# Altium schematic sheet ELC102 - Old Circuits.SchDoc
size C
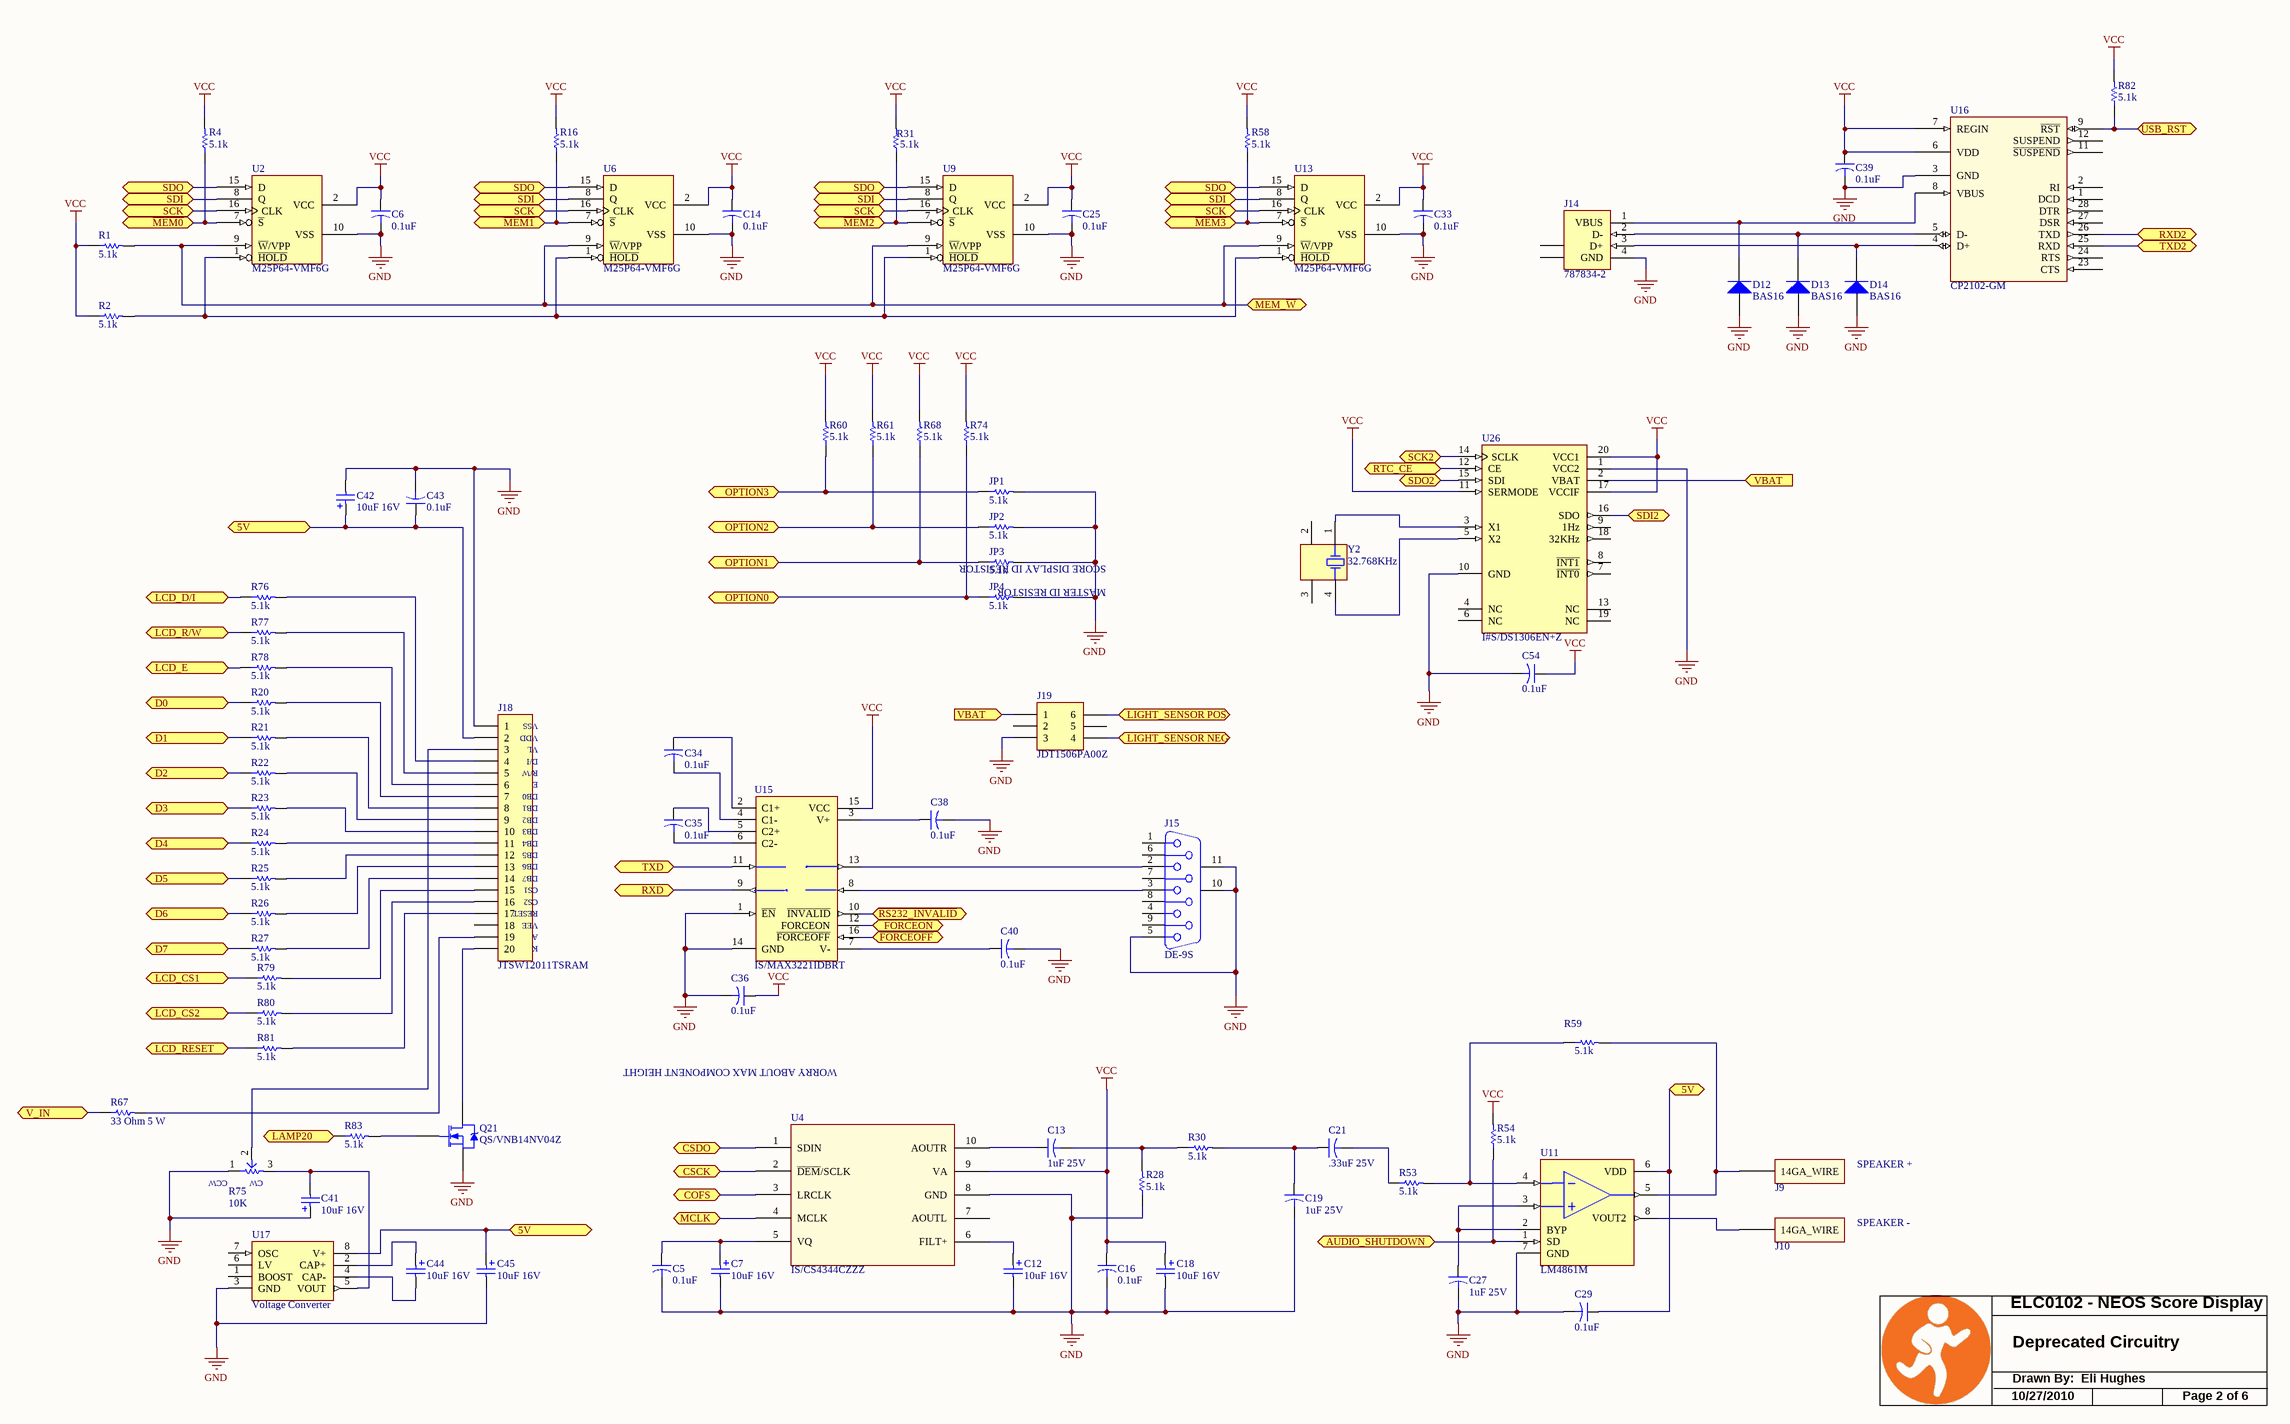
[diagram p0: ELC102 - Old Circuits.SchDoc]

## Parts
C5  0.1uF  [C0805]
C6  0.1uF  [C0805]
C7  10uF 16V  [C4X5.8]
C12  10uF 16V  [C4X5.8]
C13  1uF 25V  [R1206]
C14  0.1uF  [C0805]
C16  0.1uF  [C0805]
C18  10uF 16V  [C4X5.8]
C19  1uF 25V  [R1206]
C21  .33uF 25V  [R1206]
C25  0.1uF  [C0805]
C27  1uF 25V  [R1206]
C29  0.1uF  [C0805]
C33  0.1uF  [C0805]
C34  0.1uF  [C0805]
C35  0.1uF  [C0805]
C36  0.1uF  [C0805]
C38  0.1uF  [C0805]
C39  0.1uF  [C0805]
C40  0.1uF  [C0805]
C41  10uF 16V  [C4X5.8]
C42  10uF 16V  [C4X5.8]
C43  0.1uF  [C0805]
C44  10uF 16V  [C4X5.8]
C45  10uF 16V  [C4X5.8]
C54  0.1uF  [C0805]
D12  BAS16  [SOT23]  (no BOM)
D13  BAS16  [SOT23]  (no BOM)
D14  BAS16  [SOT23]  (no BOM)
J9  ~14GA_WIRE  [WIRE_14GA]  (value not drawn)  (no BOM)
J10  ~14GA_WIRE  [WIRE_14GA]  (value not drawn)  (no BOM)
J14  787834-2  [KUSBVX-BS1N]  (no BOM)
J15  DE-9S  [DSUBV9]  (no BOM)
J18  JTSW12011TSRAM  [JTSW12011TSRAM]
J19  JDT1506PA00Z  [JDT1506PA00Z - 2 holes]
JP1  5.1k  [R0805]
JP2  5.1k  [R0805]
JP3  5.1k  [R0805]
JP4  5.1k  [R0805]
Q21  QS/VNB14NV04Z  [D2PAK]
R1  5.1k  [R0805]
R2  5.1k  [R0805]
R4  5.1k  [R0805]
R16  5.1k  [R0805]
R20  5.1k  [R0805]
R21  5.1k  [R0805]
R22  5.1k  [R0805]
R23  5.1k  [R0805]
R24  5.1k  [R0805]
R25  5.1k  [R0805]
R26  5.1k  [R0805]
R27  5.1k  [R0805]
R28  5.1k  [R0805]
R30  5.1k  [R0805]
R31  5.1k  [R0805]
R53  5.1k  [R0805]
R54  5.1k  [R0805]
R58  5.1k  [R0805]
R59  5.1k  [R0805]
R60  5.1k  [R0805]
R61  5.1k  [R0805]
R67  33 Ohm 5 W  [RES30.6-25.5X9]
R68  5.1k  [R0805]
R74  5.1k  [R0805]
R75  10K  [P3299W]
R76  5.1k  [R0805]
R77  5.1k  [R0805]
R78  5.1k  [R0805]
R79  5.1k  [R0805]
R80  5.1k  [R0805]
R81  5.1k  [R0805]
R82  5.1k  [R0805]
R83  5.1k  [R0805]
U2  M25P64-VMF6G  [so16w]  (no BOM)
U4  IS/CS4344CZZZ  [TSSOP\10]
U6  M25P64-VMF6G  [so16w]  (no BOM)
U9  M25P64-VMF6G  [so16w]  (no BOM)
U11  LM4861M  [soic 8]
U13  M25P64-VMF6G  [so16w]  (no BOM)
U15  IS/MAX3221IDBRT  [SSOP16]  (no BOM)
U16  CP2102-GM  [QFN28]  (no BOM)
U17  Voltage Converter  [SOIC 8]
U26  I#S/DS1306EN+Z  [TSSOP-20]
Y2  32.768KHz  [ZS/MC306]

## Ports
5V, AUDIO_SHUTDOWN, COFS, CSCK, CSDO, D0, D1, D2, D3, D4, D5, D6, D7, FORCEON, LAMP20, LCD_CS1, LCD_CS2, LCD_D/I, LCD_E, LCD_R/W, LCD_RESET, LIGHT_SENSOR NEG, LIGHT_SENSOR POS, MCLK, MEM_~{W}, OPTION0, OPTION1, OPTION2, OPTION3, RTC_CE, RXD, RXD2, SCK, SCK2, SDI, SDI2, SDO, SDO2, TXD, TXD2, USB_RST, V_IN, VBAT (in), ~{FORCEOFF}, ~{MEM0}, ~{MEM1}, ~{MEM2}, ~{MEM3}, ~{RS232_INVALID}

## Nets
GND: C5.2 C6.2 C7.2 C12.2 C14.2 C16.2 C18.2 C19.2 C25.2 C27.2 C29.2 C33.2 C36.2 C38.2 C39.2 C40.2 C41.1 C42.2 C43.2 C45.2 C54.2 D12.1(A) D13.1(A) D14.1(A) J14.4(GND) J15.5 J15.10(MH1) J15.11(MH2) J18.1 J19.3 JP1.2 JP2.2 JP3.2 JP4.2 Q21.3(S) R28.1 R75.1(CCW) U2.10(VSS) U4.8(GND) U6.10(VSS) U9.10(VSS) U11.7(GND) U13.10(VSS) U15.1(~{EN}) U15.14(GND) U16.3(GND) U17.3(GND) U26.1(VCC2) U26.10(GND)
VCC: C6.1 C14.1 C16.1 C18.1 C25.1 C33.1 C36.1 C39.1 C54.1 R1.1 R2.1 R4.2 R16.2 R31.2 R54.2 R58.2 R60.2 R61.2 R68.2 R74.2 R82.2 U2.2(VCC) U4.9(VA) U6.2(VCC) U9.2(VCC) U13.2(VCC) U15.15(VCC) U16.6(VDD) U16.7(REGIN) U26.11(SERMODE) U26.17(VCCIF) U26.20(VCC1)
5V: C29.1 C42.1 C43.1 C45.1 J18.2 U11.6(VDD) U17.8(V+) ; port 5V
AUDIO_SHUTDOWN: R54.1 U11.1(SD) ; port AUDIO_SHUTDOWN
COFS: U4.3(LRCLK) ; port COFS
CSCK: U4.2(~{DEM}/SCLK) ; port CSCK
CSDO: U4.1(SDIN) ; port CSDO
D0: R20.1 ; port D0
D1: R21.1 ; port D1
D2: R22.1 ; port D2
D3: R23.1 ; port D3
D4: R24.1 ; port D4
D5: R25.1 ; port D5
D6: R26.1 ; port D6
D7: R27.1 ; port D7
~{FORCEOFF}: U15.16(~{FORCEOFF}) ; port ~{FORCEOFF}
FORCEON: U15.12(FORCEON) ; port FORCEON
LAMP20: R83.1 ; port LAMP20
LCD_CS1: R79.1 ; port LCD_CS1
LCD_CS2: R80.1 ; port LCD_CS2
LCD_D/I: R76.1 ; port LCD_D/I
LCD_E: R78.1 ; port LCD_E
LCD_R/W: R77.1 ; port LCD_R/W
LCD_RESET: R81.1 ; port LCD_RESET
LIGHT_SENSOR NEG: J19.4 ; port LIGHT_SENSOR NEG
LIGHT_SENSOR POS: J19.6 ; port LIGHT_SENSOR POS
~{MEM0}: R4.1 U2.7(~{S}) ; port ~{MEM0}
~{MEM1}: R16.1 U6.7(~{S}) ; port ~{MEM1}
~{MEM2}: R31.1 U9.7(~{S}) ; port ~{MEM2}
~{MEM3}: R58.1 U13.7(~{S}) ; port ~{MEM3}
MCLK: U4.4(MCLK) ; port MCLK
MEM_~{W}: R1.2 U2.9(~{W}/VPP) U6.9(~{W}/VPP) U9.9(~{W}/VPP) U13.9(~{W}/VPP) ; port MEM_~{W}
OPTION0: JP4.1 R74.1 ; port OPTION0
OPTION1: JP3.1 R68.1 ; port OPTION1
OPTION2: JP2.1 R61.1 ; port OPTION2
OPTION3: JP1.1 R60.1 ; port OPTION3
~{RS232_INVALID}: U15.10(~{INVALID}) ; port ~{RS232_INVALID}
RTC_CE: U26.12(CE) ; port RTC_CE
RXD: U15.9(R1OUT) ; port RXD
RXD2: U16.26(TXD) ; port RXD2
SCK: U2.16(CLK) U6.16(CLK) U9.16(CLK) U13.16(CLK) ; port SCK
SCK2: U26.14(SCLK) ; port SCK2
SDI: U2.8(Q) U6.8(Q) U9.8(Q) U13.8(Q) ; port SDI
SDI2: U26.16(SDO) ; port SDI2
SDO: U2.15(D) U6.15(D) U9.15(D) U13.15(D) ; port SDO
SDO2: U26.15(SDI) ; port SDO2
TXD: U15.11(T1IN) ; port TXD
TXD2: U16.25(RXD) ; port TXD2
USB_RST: R82.1 U16.9(~{RST}) ; port USB_RST
V_IN: R67.1 ; port V_IN
VBAT: J19.1 U26.2(VBAT) ; port VBAT
NetC5_1: C5.1 C7.1 U4.5(VQ)
NetC12_1: C12.1 U4.6(FILT+)
NetC13_1: C13.1 U4.10(AOUTR)
NetC13_2: C13.2 R28.2 R30.1
NetC19_1: C19.1 C21.1 R30.2
NetC21_2: C21.2 R53.1
NetC27_1: C27.1 U11.2(BYP) U11.3(IN+)
NetC34_1: C34.1 U15.2(C1+)
NetC34_2: C34.2 U15.4(C1-)
NetC35_1: C35.1 U15.5(C2+)
NetC35_2: C35.2 U15.6(C2-)
NetC38_1: C38.1 U15.3(V+)
NetC40_1: C40.1 U15.7(V-)
NetC41_2: C41.2 R75.3(CW) U17.5(VOUT)
NetC44_1: C44.1 U17.2(CAP+)
NetC44_2: C44.2 U17.4(CAP-)
NetD12_3: D12.3(K) J14.1(VBUS) U16.8(VBUS)
NetD13_3: D13.3(K) J14.2(D-) U16.5(D-)
NetD14_3: D14.3(K) J14.3(D+) U16.4(D+)
NetJ9_1: J9.1(14GA_WIRE) R59.2 U11.5(VOUT1)
NetJ10_1: J10.1(14GA_WIRE) U11.8(VOUT2)
NetJ15_2: J15.2 U15.13(T1OUT)
NetJ15_3: J15.3 U15.8(R1IN)
NetJ18_3: J18.3 R75.2(T)
NetJ18_4: J18.4 R76.2
NetJ18_5: J18.5 R77.2
NetJ18_6: J18.6 R78.2
NetJ18_7: J18.7 R20.2
NetJ18_8: J18.8 R21.2
NetJ18_9: J18.9 R22.2
NetJ18_10: J18.10 R23.2
NetJ18_11: J18.11 R24.2
NetJ18_12: J18.12 R25.2
NetJ18_13: J18.13 R26.2
NetJ18_14: J18.14 R27.2
NetJ18_15: J18.15 R79.2
NetJ18_16: J18.16 R80.2
NetJ18_17: J18.17 R81.2
NetJ18_19: J18.19 R67.2
NetJ18_20: J18.20 Q21.2(D)
NetQ21_1: Q21.1(G) R83.2
NetR2_2: R2.2 U2.1(~{HOLD}) U6.1(~{HOLD}) U9.1(~{HOLD}) U13.1(~{HOLD})
NetR53_2: R53.2 R59.1 U11.4(IN-)
NetU26_3: U26.3(X1) Y2.1(OSC1)
NetU26_5: U26.5(X2) Y2.4(OSC2)

Not connected (* = marked no-connect by the designer): J14 5(SHLD) 6(SHLD); J15 1 4 6 7 8 9; J18 18; J19 2 5; U4 7(AOUTL); U16 1(DCD) 2(RI) 11(~{SUSPEND}) 12(SUSPEND) 23(CTS) 24(RTS) 27(DSR) 28(DTR); U17 1(BOOST) 6(LV) 7(OSC); U26 4(NC) 6(NC) 7(~{INT0}) 8(~{INT1}) 9(1Hz) 13(NC) 18(32KHz) 19(NC); Y2 2(COM) 3(COM)

## Notes on the sheet
- MASTER ID RESISTOR
- SCORE DISPLAY ID RESISTOR
- (near J18) VSS
- (near J18) VDD
- (near J18) VL
- (near J18) R/W
- (near J18) D/I
- (near J18) E
- (near J18) DB0
- (near J18) DB1
- (near J18) DB2
- (near J18) DB3
- (near J18) DB4
- (near J18) DB5
- (near J18) DB6
- (near J18) DB7
- (near J18) CS1
- (near J18) CS2
- (near J18) RESET
- (near J18) VEE
- (near J18) A
- (near J18) K
- WORRY ABOUT MAX COMPONENT HEIGHT
- SPEAKER +
- SPEAKER -
- ELC0102 - NEOS Score Display
- Deprecated Circuitry
- 10/27/2010
- Drawn By:  Eli Hughes
- Page 2 of 6

## Library data of the parts
C5 C6 C14 C16 C25 C29 C33-C36 C38-C40 C43 C54 = CS/C0805C104K5RACK: CAP .10UF 50V CERAMIC X7R 0805; Manufacturer: Kemet; Manufacturer Part Number: C0805C104K5RACTU; Source Part Number: 399-1170-2-ND; Capacitance: 0.1µF; Tolerance: ±10%; ROHS Certificate: Lead free / RoHS compliant; Source: Digikey; Value: 0.1uF; Supplier 1: Digi-Key; RoHS: RoHS Compliant; Category: Capacitors; Stock 1: 10120790; Pricing 1: 10=0.105, 100=0.0378, 250=0.02732, 500=0.02016, 1000=0.01365 (USD); Voltage - Rated: 50V; Temperature Coefficient: X7R; Mounting Type: Surface Mount, MLCC; Operating Temperature: -55°C ~ 125°C; Features: -; Applications: General Purpose; Ratings: -; Package / Case: 0805 (2012 Metric); Size / Dimension: 0.079" L x 0.049" W (2.00mm x 1.25mm); Lead Spacing: -; Thickness: 0.90mm; Packaging: Cut Tape (CT); Lead Style: -; ComponentLink1URL: http://www.kemet.com/datasheets&C0805C104K5RACTU; ComponentLink1Description: http://www.kemet.com/datasheets&C0805C104K5RACTU; Supplier Part Number 1: 399-1170-1-ND
C7 C12 C18 C41 C42 C44 C45 = CS/EEVFK1C100RP: Panasonic 10uF 16V SMT; Manufacturer: Panasonic - ECG; Manufacturer Part Number: EEE-FK1C100R; Source Part Number: PCE3782TR-ND; Value: EEE-FK1C100R; Description: CAP ELECT 10UF 16V FK SMD; Capacitance: 10µF; Tolerance: ±20%; Lifetime @ Temp.: 2000 Hrs @ 105°C; Ripple Current: 90mA; Impedance: 1.35 Ohm; Surface Mount Land Size: 0.169" L x 0.169" W (4.30mm x 4.30mm); ROHS Certificate: Lead free / RoHS compliant; Source: Digikey; Supplier 1: Digi-Key; RoHS: RoHS Compliant; Category: Capacitors; Stock 1: 412703; Pricing 1: 1=0.54, 50=0.309, 100=0.2575, 250=0.19312, 500=0.1648, 1000=0.12875 (USD); Voltage Rating: 16V; Operating Temperature: -55°C ~ 105°C; Features: General Purpose; ESR (Equivalent Series Resistance): -; Mounting Type: Surface Mount; Package / Case: Radial, Can - SMD; Size / Dimension: 0.157" Dia (4.00mm); Height: 0.228" (5.80mm); Lead Spacing: -; Packaging: Cut Tape (CT); ComponentLink1URL: http://industrial.panasonic.com/www-cgi/jvcr13pz.cgi?E+PZ+3+ABA0120+EEEFK1C100R+7+WW; ComponentLink1Description: http://industrial.panasonic.com/www-cgi/jvcr13pz.cgi?E+PZ+3+ABA0120+EEEFK1C100R+7+WW; Supplier Part Number 1: PCE3782CT-ND
C13 C19 C27 = CS/ECJ3YB1E105KP: 1uF 25V 1206 Panasonic; Manufacturer: Panasonic - ECG; Manufacturer Part Number: ECJ-3YB1E105K; Description: CAP 1UF 25V CERAMIC X7R 1206; Capacitance: 1.0µF; Tolerance: ±10%; Temperature Coefficient: X7R; Published: 23-Sep-2002; Publisher: Altium Limited; Supplier 1: Digi-Key; RoHS: RoHS Compliant; Category: Capacitors; Stock 1: 0; Voltage - Rated: 25V; Mounting Type: Surface Mount, MLCC; Operating Temperature: -55°C ~ 125°C; Features: Low ESR; Applications: General Purpose; Ratings: -; Package / Case: 1206 (3216 Metric); Size / Dimension: 0.126" L x 0.063" W (3.20mm x 1.60mm); Lead Spacing: -; Thickness: 1.60mm; Packaging: Cut Tape (CT); Lead Style: -; ComponentLink1URL: http://media.digikey.com/pdf/Data%20Sheets/Panasonic%20Capacitors%20PDFs/ECJ(HighCapacitance).pdf; ComponentLink1Description: http://media.digikey.com/pdf/Data%20Sheets/Panasonic%20Capacitors%20PDFs/ECJ(HighCapacitance).pdf; Supplier Part Number 1: PCC1893CT-ND
C21 = CS/ECJ3VB1E334KP: .33uF 25V 1206 Panasonic; Manufacturer: Panasonic - ECG; Manufacturer Part Number: ECJ-3VB1E334K; Description: CAP .33UF 25V CERAMIC X7R 1206; Capacitance: 0.33µF; Tolerance: ±10%; Temperature Coefficient: X7R; Published: 23-Sep-2002; Publisher: Altium Limited; Supplier 1: Digi-Key; RoHS: RoHS Compliant; Category: Capacitors; Stock 1: 0; Voltage - Rated: 25V; Mounting Type: Surface Mount, MLCC; Operating Temperature: -55°C ~ 125°C; Features: Low ESR; Applications: General Purpose; Ratings: -; Package / Case: 1206 (3216 Metric); Size / Dimension: 0.126" L x 0.063" W (3.20mm x 1.60mm); Lead Spacing: -; Thickness: 0.85mm; Packaging: Cut Tape (CT); Lead Style: -; ComponentLink1URL: http://industrial.panasonic.com/www-cgi/jvcr13pz.cgi?E+PZ+3+ABJ0001+ECJ3VB1E334K+7+WW; ComponentLink1Description: http://industrial.panasonic.com/www-cgi/jvcr13pz.cgi?E+PZ+3+ABJ0001+ECJ3VB1E334K+7+WW; Supplier Part Number 1: PCC1889CT-ND
D12-D14 = DS/BAS16000Z: Zetex BAS16 Diode; Manufacturer: Diodes Inc; Manufacturer Part Number: BAS16-7-F; Note: Pin 2 is not connected and not drawn.; Description: DIODE SWITCH 75V 350MW SOT23-3; Voltage - Forward (Vf) (Max) @ If: 1.25V @ 150mA; Voltage - DC Reverse (Vr) (Max): 75V; Current - Average Rectified (Io): 200mA; Current - Reverse Leakage @ Vr: 1µA @ 75V; Diode Type: Standard; Speed: Small Signal =< 200mA (Io), Any Speed; Reverse Recovery Time (trr): 4ns; Capacitance @ Vr, F: 2pF @ 0V, 1MHz; Published: 21-Mar-2003; DatasheetDocument: Oct-1999; PackageDocument: Sep-2001; PackageReference: SOT-23; Publisher: Altium Limited; ComponentLink1Description: Manufacturer Link; ComponentLink1URL: http://www.infineon.com/; Supplier 1: Digi-Key; RoHS: RoHS Compliant; Category: Discrete Semiconductor Products; Stock 1: 856038; Pricing 1: 1=0.3, 10=0.198, 100=0.086, 250=0.05592, 500=0.03956, 1000=0.02795 (USD); Mounting Type: Surface Mount; Package / Case: SOT-23-3, TO-236-3, Micro3™, SSD3, SST3; Packaging: Cut Tape (CT); Supplier Device Package: *; ComponentLink2URL: http://www.diodes.com/datasheets/ds12003.pdf; ComponentLink2Description: http://www.diodes.com/datasheets/ds12003.pdf; Supplier Part Number 1: BAS16-FDICT-ND
J14 = 787834-2: USB 1.1, Vertical, Thru-Hole, B Type, Receptacle, 4 Position, Natural; Manufacturer: Tyco Electronics; Manufacturer Part Number: 5787834-2; ContactMaterial: Copper Alloy; ContactPlating: Gold Flash over Palladium Nickel or Gold (30) over Nickel; TerminationLength: 3.02mm [0.119in.]; PCB_Layout: Complies with manufacturer's recommendation.; DrillSize: Corresponds to nominal value.; PanelGround: Without; Description: CONN RCPT USB TYPE B PCB VERT; Connector Type: USB - B; Number of Contacts: 4; Specifications: USB 2.0; Published: 15-Jul-2004; DatasheetDocument: 11-Jan-2004; PackageDocument: 11-Jan-2004; PackageReference: 787834; Publisher: Altium Limited; HousingMaterial: Thermoplastic; ComponentLink1Description: Manufacturer Link; ComponentLink1URL: http://www.tycoelectronics.com/; ComponentLink2Description: Packaging Specification; ComponentLink2URL: http://ecommas.tycoelectronics.com/commerce/DocumentDelivery/DDEController?Action=showdoc&DocId=Customer+Drawing%7F787834%7FG%7Ftif%7FEnglish%7FC_787834_G.tif; Supplier 1: Digi-Key; RoHS: RoHS Compliant; Category: Connectors, Interconnects; Stock 1: 0; Pricing 1: 1008=1.37655 (USD); Gender: Receptacle; Mounting Type: Through Hole, Vertical; Features: Board Lock; Packaging: Tray; ComponentLink3URL: http://documents.tycoelectronics.com/commerce/DocumentDelivery/DDEController?Action=srchrtrv&DocNm=5787834&DocType=CD&DocLang=EN; ComponentLink3Description: http://documents.tycoelectronics.com/commerce/DocumentDelivery/DDEController?Action=srchrtrv&DocNm=5787834&DocType=CD&DocLang=EN; Supplier Part Number 1: 5787834-2-ND
J15 = JK85ED9SBR0Z: D-Sub 9S Kycon Straight W/retainers; PackageDocument: O; Positions: 9; Gender: Receptacle; Published: 15-Jun-2001; LatestRevisionDate: 17-Jul-2002; LatestRevisionNote: Re-released for DXP Platform.; DatasheetDocument: 1-Sep-1999; PackageReference: 788750; Publisher: Altium Limited; Orientation: Right Angle
J18 = JTSW12011TSRAM: Samtec Header RA 20P Stood off board; LatestRevisionDate: 17-Jul-2002; LatestRevisionNote: Re-released for DXP Platform.; Publisher: Altium Limited
J19 = JDT1506PA00Z: Deutsch 6P Sealed PCB connector; Supplier 1: *; Supplier Part Number 1: *
JP1-JP4 R1 R2 R4 R16 R20-R28 R30 R31 R53 R54 R58-R61 R68 R74 R76-R83 = ERJ-6ENF5101V: RES 5.10K OHM 1/8W 1% 0805 SMD; Manufacturer: Panasonic - ECG; Power (Watts): 0.125W, 1/8W; Temperature Coefficient: ±100ppm/°C; ComponentLink1Description: http://industrial.panasonic.com/www-cgi/jvcr13pz.cgi?E+PZ+3+AOA0002+ERJ6ENF5101V+7+WW; ComponentLink1URL: http://industrial.panasonic.com/www-cgi/jvcr13pz.cgi?E+PZ+3+AOA0002+ERJ6ENF5101V+7+WW; Value: 5.1k; Supplier 1: Digi-Key; Manufacturer Part Number: ERJ-6ENF5101V; RoHS: RoHS Compliant; Category: Resistors; Stock 1: 32293; Pricing 1: 1=0.07, 50=0.0276, 100=0.021, 250=0.0156, 500=0.01152, 1000=0.00768 (USD); Resistance In Ohms: 5.10K; Composition: Thick Film; Features: -; Tolerance: ±1%; Case: 0805 (2012 metric); Size / Dimension: 0.079" L x 0.049" W (2.00mm x 1.25mm); Height: 0.024" (0.60mm); Lead Style: Surface Mount (SMD - SMT); Packaging: Digi-Reel®; Supplier Part Number 1: P5.10KCDKR-ND
Q21 = QS/VNB14NV04Z: HEXFET Power MOSFET; Manufacturer: STMicroelectronics; Source Part Number: VNB14NV04-ND; Description: MOSFET POWER 40V 12A D2PAK; Type: Low Side; Input Type: Non-Inverting; Number of Outputs: 1; On-State Resistance: 35 mOhm; Current - Peak Output: 18A; Manufacturer Part Number: VNB14NV04; ROHS Certificate: Lead free / RoHS compliant; Source: Digikey; Value: VNB14NV04; Supplier 1: Digi-Key; RoHS: RoHS Compliant; Category: Integrated Circuits (ICs); Stock 1: 0; Pricing 1: 800=1.5495 (USD); Current - Output / Channel: -; Voltage - Supply: -; Operating Temperature: -; Mounting Type: Surface Mount; Package / Case: TO-263-2, D²Pak (2 leads + Tab), TO-263AB; Packaging: Tube; Supplier Device Package: *; ComponentLink1URL: http://www.st.com/stonline/products/literature/ds/1643/vnb14n04.pdf; ComponentLink1Description: http://www.st.com/stonline/products/literature/ds/1643/vnb14n04.pdf; Supplier Part Number 1: VNB14NV04-ND
R67 = RES 5W: Resistor 5W square ceramic; Published: 8-Jun-2000; LatestRevisionDate: 17-Jul-2002; LatestRevisionNote: Re-released for DXP Platform.; Publisher: Altium Limited
R75 = P3299W11030B: Bourns Trim Pot 10K Vertical; Published: 8-Jun-2000; LatestRevisionDate: 17-Jul-2002; LatestRevisionNote: Re-released for DXP Platform.; PackageReference: AXIAL-0.3; Publisher: Altium Limited
U2 U6 U9 U13 = IS/M25P64VMF6GZ: ST Serial memory 64MBit SOIC-16; Manufacturer: NUMONYX; Manufacturer Part Number: M25P64-VMF6P; Description: NUMONYX - M25P64-VMF6P - IC, FLASH, 64MBIT, 75MHZ, SOIC-16; Memory Size: 64; Interface: SPI; Memory Configuration: 8M x 8; Clock Frequency: 75; Supply Voltage Range: 2.7V to 3.6; Memory Case Style: SOIC; No. of Pins: 16; Supplier 1: Newark; Category: Semiconductors - ICs; Stock 1: 1514; Pricing 1: 1=10.48, 10=10.2, 100=9.39, 250=8.13, 500=7.5 (USD); ComponentLink1URL: http://www.numonyx.com/Documents/Datasheets/M25P64.pdf; ComponentLink1Description: http://www.numonyx.com/Documents/Datasheets/M25P64.pdf; Supplier Part Number 1: 37M4673
U4 = IS/CS4344CZZZ: Cirrus 24 bit DAC; Manufacturer: Cirrus Logic Inc; Manufacturer Part Number: CS4344-CZZR; Description: IC DAC 24BIT 192KHZ 10-TSSOP; Number of Bits: 24; Data Interface: Serial; Number of Converters: 2; Voltage Supply Source: Single Supply; Power Dissipation (Max): 150mW; Supplier 1: Digi-Key; RoHS: RoHS Compliant; Category: Integrated Circuits (ICs); Stock 1: 0; Pricing 1: 2000=1.4364 (USD); Settling Time: -; Operating Temperature: -10°C ~ 70°C; Mounting Type: Surface Mount; Package / Case: 10-TSSOP; Packaging: Tube; Supplier Device Package: *; Supplier Part Number 1: CS4344-CZZR-ND
U11 = LM4861M: 1.1 Audio Power Amplifier with Shutdown Mode; Manufacturer: National Semiconductor; Manufacturer Part Number: LM4861MX; Description: IC AMP AUDIO PWR 1.5W MONO 8SOIC; Output Type: 1-Channel (Mono); Max Output Power x Channels @ Load: 1.5W x 1 @ 8 Ohm; Voltage - Supply: 2 V ~ 5.5 V; Published: 15-Apr-2002; LatestRevisionDate: 06-Jun-2005; LatestRevisionNote: Stylized 3D Model Added.; DatasheetDocument: May-1997; PackageDocument: Sep-1997; PackageReference: M08A; Publisher: Altium Limited; Code_JEDEC: MS-012-AA; Code_IPC: SO8; ComponentLink1Description: Manufacturer Link; ComponentLink1URL: http://www.national.com/; ComponentLink2Description: Datasheet; ComponentLink2URL: http://www.national.com/ds.cgi/LM/LM4861.pdf; ComponentLink3Description: URL Link1; ComponentLink3URL: http://www.national.com/pf/LM/LM4861.html; Supplier 1: Digi-Key; RoHS: RoHS Compliant; Category: Integrated Circuits (ICs); Stock 1: 9270; Pricing 1: 1=1.93, 25=1.4852, 100=1.3475, 250=1.21, 500=1.045, 1000=0.88 (USD); Type: Class AB; Features: Shutdown, Thermal Protection; Mounting Type: Surface Mount; Package / Case: 8-SOIC (0.154", 3.90mm Width); Packaging: Cut Tape (CT); Supplier Device Package: *; ComponentLink4URL: http://www.national.com/ds/LM/LM4861.pdf; ComponentLink4Description: http://www.national.com/ds/LM/LM4861.pdf; Supplier Part Number 1: LM4861MXCT-ND
U15 = IS/MAX3221IDBRT: TI 3.3V RS-232 chip 16-SSOP; Manufacturer: Texas Instruments; PackageDocument: 1996; Description: IC DRVR/RCVR RS-232 1-CH 16-SSOP; Number of Drivers/Receivers: 1/1; Protocol: RS232; Voltage - Supply: 3 V ~ 5.5 V; Published: 16-Jan-2001; LatestRevisionDate: 6-Jun-2005; LatestRevisionNote: Stylized 3D Model Added.; DatasheetDocument: Jan-1998; PackageReference: SSOP16; Publisher: Altium Limited; ComponentLink1Description: Manufacturer Link; ComponentLink1URL: http://www.maxim-ic.com/; ComponentLink2Description: Datasheet; ComponentLink2URL: http://pdfserv.maxim-ic.com/en/ds/MAX3221E-MAX3243E.pdf; Supplier 1: Digi-Key; Manufacturer Part Number: MAX3221IDBR; RoHS: RoHS Compliant; Category: Integrated Circuits (ICs); Stock 1: 35498; Pricing 1: 1=2.28, 25=1.7552, 100=1.5925, 250=1.43, 500=1.235, 1000=1.04 (USD); Type: Transceiver; Mounting Type: Surface Mount; Package / Case: 16-SSOP; Packaging: Cut Tape (CT); Supplier Device Package: *; ComponentLink3URL: http://focus.ti.com/lit/ds/symlink/max3221.pdf; ComponentLink3Description: http://focus.ti.com/lit/ds/symlink/max3221.pdf; Supplier Part Number 1: 296-9595-1-ND
U16 = IS/CP2102GMZ: Silicon Labs USB to UART bridge QFN-28; Manufacturer: Silicon Laboratories  Inc; Description: IC USB-TO-UART BRIDGE 28VQFN; Voltage - Supply: 3 V ~ 3.6 V; Supplier 1: Digi-Key; Manufacturer Part Number: CP2102-GM; RoHS: RoHS Compliant; Category: Integrated Circuits (ICs); Stock 1: 51554; Pricing 1: 1=3.01, 25=2.832, 100=2.655, 1000=2.5488 (USD); Applications: USB; Interface: UART; Package / Case: 28-VQFN Exposed Pad, 28-HVQFN, 28-SQFN, 28-DHVQFN; Packaging: Tube; Mounting Type: Surface Mount; Supplier Device Package: *; ComponentLink1URL: https://www.silabs.com/Support%20Documents/TechnicalDocs/cp2102.pdf; ComponentLink1Description: https://www.silabs.com/Support%20Documents/TechnicalDocs/cp2102.pdf; Supplier Part Number 1: 336-1160-ND
U17 = IS/ICL7660ACBA: Switched Capacitor Voltage Converter; Manufacturer: Intersil; Manufacturer Part Number: ICL7660ACBAZA-T; Description: IC VOLTAGE CONVERTER CMOS 8-SOIC; Internal Switch(s): Yes; Synchronous Rectifier: No; Number of Outputs: 1; Frequency - Switching: 10kHz; Voltage - Input: 1.5 ~ 12 V; Published: 15-Apr-2002; LatestRevisionDate: 06-Jun-2005; LatestRevisionNote: Stylized 3D Model Added.; DatasheetDocument: Apr-1997; PackageDocument: Sep-1997; PackageReference: M08A; Publisher: Altium Limited; Code_JEDEC: MS-012-AA; Code_IPC: SO8; ComponentLink1Description: Manufacturer Link; ComponentLink1URL: http://www.national.com/; ComponentLink2Description: Datasheet; ComponentLink2URL: http://www.national.com/ds.cgi/LM/LMC7660.pdf; ComponentLink3Description: URL Link1; ComponentLink3URL: http://www.national.com/pf/LM/LMC7660.html; Supplier 1: Digi-Key; RoHS: RoHS Compliant; Category: Integrated Circuits (ICs); Stock 1: 6618; Pricing 1: 1=1.76, 25=0.98, 100=0.784 (USD); Type: Switched Capacitor (Charge Pump), Inverting; Voltage - Output: -; Current - Output: -; Power - Output: -; Operating Temperature: 0°C ~ 70°C; Mounting Type: Surface Mount; Package / Case: 8-SOIC (0.154", 3.90mm Width); Packaging: Cut Tape (CT); Supplier Device Package: *; ComponentLink4URL: http://www.intersil.com/data/fn/fn3072.pdf; ComponentLink4Description: http://www.intersil.com/data/fn/fn3072.pdf; Supplier Part Number 1: ICL7660ACBAZA-TCT-ND
U26 = I#S/DS1306EN+Z: Serial Alarm Real-Time Clock; Manufacturer: Maxim Integrated Products; PackageDocument: 1999; Description: IC RTC SERIAL ALARM IND 20-TSSOP; Memory Size: 96B; Time Format: HH:MM:SS (12/24 hr); Date Format: YY-MM-DD-dd; Interface: SPI, 3-Wire Serial; Voltage - Supply: 2 V ~ 5.5 V; Published: 13-Oct-2000; LatestRevisionDate: 06-Jun-2005; LatestRevisionNote: Stylized 3D Model Added.; DatasheetDocument: 20-Aug-1999; PackageReference: DIP16; Publisher: Altium Limited; ComponentLink1Description: Manufacturer Link; ComponentLink1URL: http://www.maxim-ic.com/; ComponentLink2Description: Datasheet; ComponentLink2URL: http://pdfserv.maxim-ic.com/en/ds/DS1306.pdf; ComponentLink3Description: Discontinuation Notice; ComponentLink3URL: http://www.maxim-ic.com/qa/pdfs/non-obsolescence-letter.pdf; Supplier 1: Digi-Key; Manufacturer Part Number: DS1306EN+; RoHS: RoHS Compliant; Category: Integrated Circuits (ICs); Stock 1: 17260; Pricing 1: 1=6.33, 25=4.22, 100=3.06, 500=2.6375 (USD); Type: Clock/Calendar/Alarm; Operating Temperature: -40°C ~ 85°C; Mounting Type: Surface Mount; Package / Case: 20-TSSOP; Packaging: Tube; Supplier Device Package: *; ComponentLink4URL: http://datasheets.maxim-ic.com/en/ds/DS1306.pdf; ComponentLink4Description: http://datasheets.maxim-ic.com/en/ds/DS1306.pdf; Supplier Part Number 1: DS1306EN+-ND
Y2 = ZS/MC30632.768KE3Z: Epson MC-306 32.768K-E3; Published: 17-Jul-2002; DatasheetDocument: 18-Apr-2000; PackageReference: ECX-3M; Publisher: Altium Limited; ComponentLink1Description: Manufacturer Link; ComponentLink1URL: http://www.ecsxtal.com/